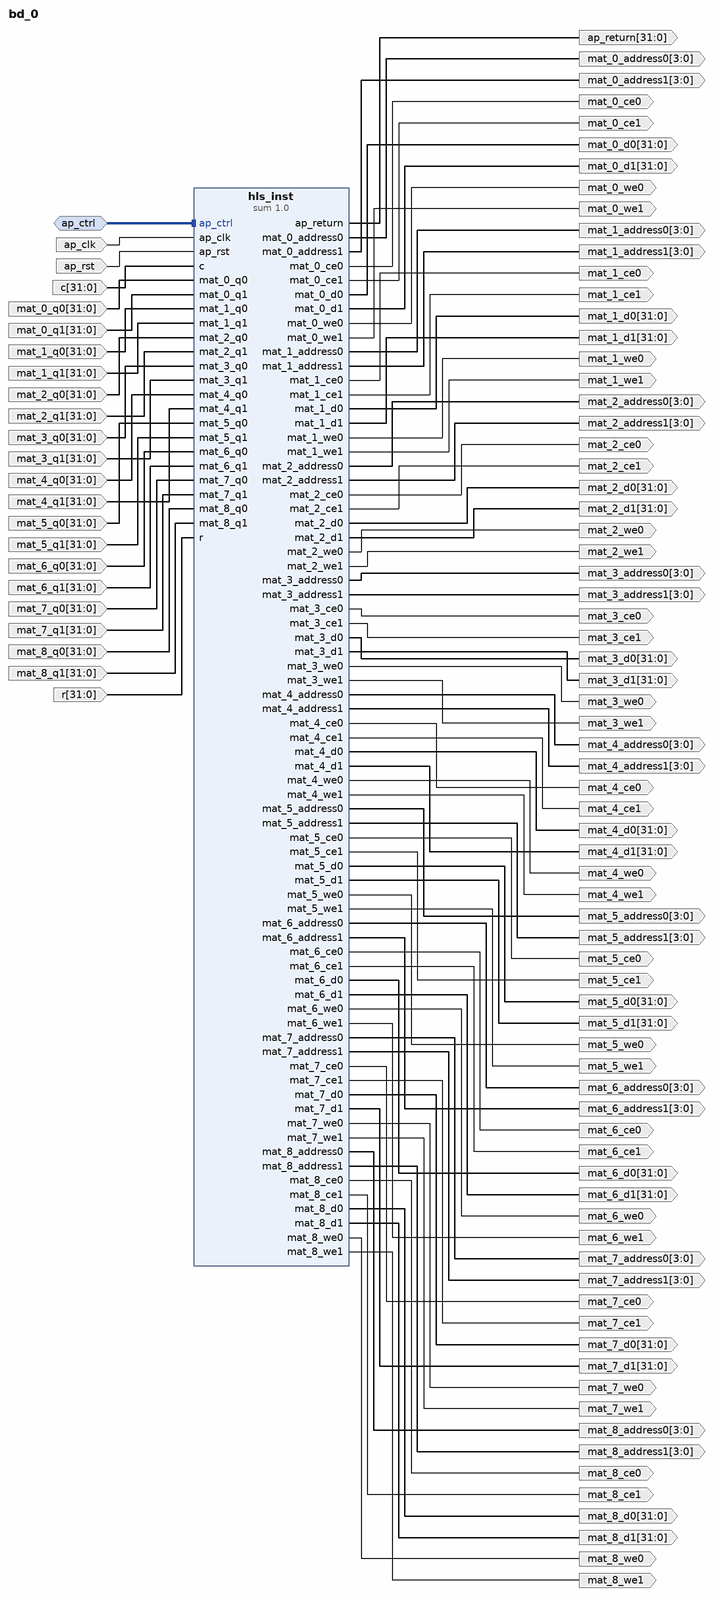
[diagram p0: block diagram of the top level]
# Vivado block design bd_0, xcvu9p-flgc2104-1-e, Vivado 2019.1
create_bd_design bd_0

create_bd_intf_port -mode Slave -vlnv xilinx.com:interface:acc_handshake_rtl:1.0 ap_ctrl
create_bd_port -dir I -type clk ap_clk
set_property -dict {CONFIG.FREQ_HZ 359000000.0} [get_bd_ports ap_clk]
create_bd_port -dir O -from 31 -to 0 -type data ap_return
create_bd_port -dir I -type rst ap_rst
set_property -dict {CONFIG.POLARITY ACTIVE_HIGH} [get_bd_ports ap_rst]
create_bd_port -dir I -from 31 -to 0 -type data c
create_bd_port -dir O -from 3 -to 0 -type data mat_0_address0
create_bd_port -dir O -from 3 -to 0 -type data mat_0_address1
create_bd_port -dir O mat_0_ce0
create_bd_port -dir O mat_0_ce1
create_bd_port -dir O -from 31 -to 0 -type data mat_0_d0
create_bd_port -dir O -from 31 -to 0 -type data mat_0_d1
create_bd_port -dir I -from 31 -to 0 -type data mat_0_q0
create_bd_port -dir I -from 31 -to 0 -type data mat_0_q1
create_bd_port -dir O mat_0_we0
create_bd_port -dir O mat_0_we1
create_bd_port -dir O -from 3 -to 0 -type data mat_1_address0
create_bd_port -dir O -from 3 -to 0 -type data mat_1_address1
create_bd_port -dir O mat_1_ce0
create_bd_port -dir O mat_1_ce1
create_bd_port -dir O -from 31 -to 0 -type data mat_1_d0
create_bd_port -dir O -from 31 -to 0 -type data mat_1_d1
create_bd_port -dir I -from 31 -to 0 -type data mat_1_q0
create_bd_port -dir I -from 31 -to 0 -type data mat_1_q1
create_bd_port -dir O mat_1_we0
create_bd_port -dir O mat_1_we1
create_bd_port -dir O -from 3 -to 0 -type data mat_2_address0
create_bd_port -dir O -from 3 -to 0 -type data mat_2_address1
create_bd_port -dir O mat_2_ce0
create_bd_port -dir O mat_2_ce1
create_bd_port -dir O -from 31 -to 0 -type data mat_2_d0
create_bd_port -dir O -from 31 -to 0 -type data mat_2_d1
create_bd_port -dir I -from 31 -to 0 -type data mat_2_q0
create_bd_port -dir I -from 31 -to 0 -type data mat_2_q1
create_bd_port -dir O mat_2_we0
create_bd_port -dir O mat_2_we1
create_bd_port -dir O -from 3 -to 0 -type data mat_3_address0
create_bd_port -dir O -from 3 -to 0 -type data mat_3_address1
create_bd_port -dir O mat_3_ce0
create_bd_port -dir O mat_3_ce1
create_bd_port -dir O -from 31 -to 0 -type data mat_3_d0
create_bd_port -dir O -from 31 -to 0 -type data mat_3_d1
create_bd_port -dir I -from 31 -to 0 -type data mat_3_q0
create_bd_port -dir I -from 31 -to 0 -type data mat_3_q1
create_bd_port -dir O mat_3_we0
create_bd_port -dir O mat_3_we1
create_bd_port -dir O -from 3 -to 0 -type data mat_4_address0
create_bd_port -dir O -from 3 -to 0 -type data mat_4_address1
create_bd_port -dir O mat_4_ce0
create_bd_port -dir O mat_4_ce1
create_bd_port -dir O -from 31 -to 0 -type data mat_4_d0
create_bd_port -dir O -from 31 -to 0 -type data mat_4_d1
create_bd_port -dir I -from 31 -to 0 -type data mat_4_q0
create_bd_port -dir I -from 31 -to 0 -type data mat_4_q1
create_bd_port -dir O mat_4_we0
create_bd_port -dir O mat_4_we1
create_bd_port -dir O -from 3 -to 0 -type data mat_5_address0
create_bd_port -dir O -from 3 -to 0 -type data mat_5_address1
create_bd_port -dir O mat_5_ce0
create_bd_port -dir O mat_5_ce1
create_bd_port -dir O -from 31 -to 0 -type data mat_5_d0
create_bd_port -dir O -from 31 -to 0 -type data mat_5_d1
create_bd_port -dir I -from 31 -to 0 -type data mat_5_q0
create_bd_port -dir I -from 31 -to 0 -type data mat_5_q1
create_bd_port -dir O mat_5_we0
create_bd_port -dir O mat_5_we1
create_bd_port -dir O -from 3 -to 0 -type data mat_6_address0
create_bd_port -dir O -from 3 -to 0 -type data mat_6_address1
create_bd_port -dir O mat_6_ce0
create_bd_port -dir O mat_6_ce1
create_bd_port -dir O -from 31 -to 0 -type data mat_6_d0
create_bd_port -dir O -from 31 -to 0 -type data mat_6_d1
create_bd_port -dir I -from 31 -to 0 -type data mat_6_q0
create_bd_port -dir I -from 31 -to 0 -type data mat_6_q1
create_bd_port -dir O mat_6_we0
create_bd_port -dir O mat_6_we1
create_bd_port -dir O -from 3 -to 0 -type data mat_7_address0
create_bd_port -dir O -from 3 -to 0 -type data mat_7_address1
create_bd_port -dir O mat_7_ce0
create_bd_port -dir O mat_7_ce1
create_bd_port -dir O -from 31 -to 0 -type data mat_7_d0
create_bd_port -dir O -from 31 -to 0 -type data mat_7_d1
create_bd_port -dir I -from 31 -to 0 -type data mat_7_q0
create_bd_port -dir I -from 31 -to 0 -type data mat_7_q1
create_bd_port -dir O mat_7_we0
create_bd_port -dir O mat_7_we1
create_bd_port -dir O -from 3 -to 0 -type data mat_8_address0
create_bd_port -dir O -from 3 -to 0 -type data mat_8_address1
create_bd_port -dir O mat_8_ce0
create_bd_port -dir O mat_8_ce1
create_bd_port -dir O -from 31 -to 0 -type data mat_8_d0
create_bd_port -dir O -from 31 -to 0 -type data mat_8_d1
create_bd_port -dir I -from 31 -to 0 -type data mat_8_q0
create_bd_port -dir I -from 31 -to 0 -type data mat_8_q1
create_bd_port -dir O mat_8_we0
create_bd_port -dir O mat_8_we1
create_bd_port -dir I -from 31 -to 0 -type data r

create_bd_cell -type ip -vlnv xilinx.com:hls:sum:1.0 hls_inst

# ---- connections ----

connect_bd_intf_net -intf_net ap_ctrl_0_1 [get_bd_intf_ports ap_ctrl] [get_bd_intf_pins hls_inst/ap_ctrl]
connect_bd_net -net ap_clk_0_1 [get_bd_ports ap_clk] [get_bd_pins hls_inst/ap_clk]
connect_bd_net [get_bd_pins hls_inst/ap_return] [get_bd_ports ap_return]
connect_bd_net -net ap_rst_0_1 [get_bd_ports ap_rst] [get_bd_pins hls_inst/ap_rst]
connect_bd_net -net c_0_1 [get_bd_ports c] [get_bd_pins hls_inst/c]
connect_bd_net [get_bd_pins hls_inst/mat_0_address0] [get_bd_ports mat_0_address0]
connect_bd_net [get_bd_pins hls_inst/mat_0_address1] [get_bd_ports mat_0_address1]
connect_bd_net [get_bd_pins hls_inst/mat_0_ce0] [get_bd_ports mat_0_ce0]
connect_bd_net [get_bd_pins hls_inst/mat_0_ce1] [get_bd_ports mat_0_ce1]
connect_bd_net [get_bd_pins hls_inst/mat_0_d0] [get_bd_ports mat_0_d0]
connect_bd_net [get_bd_pins hls_inst/mat_0_d1] [get_bd_ports mat_0_d1]
connect_bd_net -net mat_0_q0_0_1 [get_bd_ports mat_0_q0] [get_bd_pins hls_inst/mat_0_q0]
connect_bd_net -net mat_0_q1_0_1 [get_bd_ports mat_0_q1] [get_bd_pins hls_inst/mat_0_q1]
connect_bd_net [get_bd_pins hls_inst/mat_0_we0] [get_bd_ports mat_0_we0]
connect_bd_net [get_bd_pins hls_inst/mat_0_we1] [get_bd_ports mat_0_we1]
connect_bd_net [get_bd_pins hls_inst/mat_1_address0] [get_bd_ports mat_1_address0]
connect_bd_net [get_bd_pins hls_inst/mat_1_address1] [get_bd_ports mat_1_address1]
connect_bd_net [get_bd_pins hls_inst/mat_1_ce0] [get_bd_ports mat_1_ce0]
connect_bd_net [get_bd_pins hls_inst/mat_1_ce1] [get_bd_ports mat_1_ce1]
connect_bd_net [get_bd_pins hls_inst/mat_1_d0] [get_bd_ports mat_1_d0]
connect_bd_net [get_bd_pins hls_inst/mat_1_d1] [get_bd_ports mat_1_d1]
connect_bd_net -net mat_1_q0_0_1 [get_bd_ports mat_1_q0] [get_bd_pins hls_inst/mat_1_q0]
connect_bd_net -net mat_1_q1_0_1 [get_bd_ports mat_1_q1] [get_bd_pins hls_inst/mat_1_q1]
connect_bd_net [get_bd_pins hls_inst/mat_1_we0] [get_bd_ports mat_1_we0]
connect_bd_net [get_bd_pins hls_inst/mat_1_we1] [get_bd_ports mat_1_we1]
connect_bd_net [get_bd_pins hls_inst/mat_2_address0] [get_bd_ports mat_2_address0]
connect_bd_net [get_bd_pins hls_inst/mat_2_address1] [get_bd_ports mat_2_address1]
connect_bd_net [get_bd_pins hls_inst/mat_2_ce0] [get_bd_ports mat_2_ce0]
connect_bd_net [get_bd_pins hls_inst/mat_2_ce1] [get_bd_ports mat_2_ce1]
connect_bd_net [get_bd_pins hls_inst/mat_2_d0] [get_bd_ports mat_2_d0]
connect_bd_net [get_bd_pins hls_inst/mat_2_d1] [get_bd_ports mat_2_d1]
connect_bd_net -net mat_2_q0_0_1 [get_bd_ports mat_2_q0] [get_bd_pins hls_inst/mat_2_q0]
connect_bd_net -net mat_2_q1_0_1 [get_bd_ports mat_2_q1] [get_bd_pins hls_inst/mat_2_q1]
connect_bd_net [get_bd_pins hls_inst/mat_2_we0] [get_bd_ports mat_2_we0]
connect_bd_net [get_bd_pins hls_inst/mat_2_we1] [get_bd_ports mat_2_we1]
connect_bd_net [get_bd_pins hls_inst/mat_3_address0] [get_bd_ports mat_3_address0]
connect_bd_net [get_bd_pins hls_inst/mat_3_address1] [get_bd_ports mat_3_address1]
connect_bd_net [get_bd_pins hls_inst/mat_3_ce0] [get_bd_ports mat_3_ce0]
connect_bd_net [get_bd_pins hls_inst/mat_3_ce1] [get_bd_ports mat_3_ce1]
connect_bd_net [get_bd_pins hls_inst/mat_3_d0] [get_bd_ports mat_3_d0]
connect_bd_net [get_bd_pins hls_inst/mat_3_d1] [get_bd_ports mat_3_d1]
connect_bd_net -net mat_3_q0_0_1 [get_bd_ports mat_3_q0] [get_bd_pins hls_inst/mat_3_q0]
connect_bd_net -net mat_3_q1_0_1 [get_bd_ports mat_3_q1] [get_bd_pins hls_inst/mat_3_q1]
connect_bd_net [get_bd_pins hls_inst/mat_3_we0] [get_bd_ports mat_3_we0]
connect_bd_net [get_bd_pins hls_inst/mat_3_we1] [get_bd_ports mat_3_we1]
connect_bd_net [get_bd_pins hls_inst/mat_4_address0] [get_bd_ports mat_4_address0]
connect_bd_net [get_bd_pins hls_inst/mat_4_address1] [get_bd_ports mat_4_address1]
connect_bd_net [get_bd_pins hls_inst/mat_4_ce0] [get_bd_ports mat_4_ce0]
connect_bd_net [get_bd_pins hls_inst/mat_4_ce1] [get_bd_ports mat_4_ce1]
connect_bd_net [get_bd_pins hls_inst/mat_4_d0] [get_bd_ports mat_4_d0]
connect_bd_net [get_bd_pins hls_inst/mat_4_d1] [get_bd_ports mat_4_d1]
connect_bd_net -net mat_4_q0_0_1 [get_bd_ports mat_4_q0] [get_bd_pins hls_inst/mat_4_q0]
connect_bd_net -net mat_4_q1_0_1 [get_bd_ports mat_4_q1] [get_bd_pins hls_inst/mat_4_q1]
connect_bd_net [get_bd_pins hls_inst/mat_4_we0] [get_bd_ports mat_4_we0]
connect_bd_net [get_bd_pins hls_inst/mat_4_we1] [get_bd_ports mat_4_we1]
connect_bd_net [get_bd_pins hls_inst/mat_5_address0] [get_bd_ports mat_5_address0]
connect_bd_net [get_bd_pins hls_inst/mat_5_address1] [get_bd_ports mat_5_address1]
connect_bd_net [get_bd_pins hls_inst/mat_5_ce0] [get_bd_ports mat_5_ce0]
connect_bd_net [get_bd_pins hls_inst/mat_5_ce1] [get_bd_ports mat_5_ce1]
connect_bd_net [get_bd_pins hls_inst/mat_5_d0] [get_bd_ports mat_5_d0]
connect_bd_net [get_bd_pins hls_inst/mat_5_d1] [get_bd_ports mat_5_d1]
connect_bd_net -net mat_5_q0_0_1 [get_bd_ports mat_5_q0] [get_bd_pins hls_inst/mat_5_q0]
connect_bd_net -net mat_5_q1_0_1 [get_bd_ports mat_5_q1] [get_bd_pins hls_inst/mat_5_q1]
connect_bd_net [get_bd_pins hls_inst/mat_5_we0] [get_bd_ports mat_5_we0]
connect_bd_net [get_bd_pins hls_inst/mat_5_we1] [get_bd_ports mat_5_we1]
connect_bd_net [get_bd_pins hls_inst/mat_6_address0] [get_bd_ports mat_6_address0]
connect_bd_net [get_bd_pins hls_inst/mat_6_address1] [get_bd_ports mat_6_address1]
connect_bd_net [get_bd_pins hls_inst/mat_6_ce0] [get_bd_ports mat_6_ce0]
connect_bd_net [get_bd_pins hls_inst/mat_6_ce1] [get_bd_ports mat_6_ce1]
connect_bd_net [get_bd_pins hls_inst/mat_6_d0] [get_bd_ports mat_6_d0]
connect_bd_net [get_bd_pins hls_inst/mat_6_d1] [get_bd_ports mat_6_d1]
connect_bd_net -net mat_6_q0_0_1 [get_bd_ports mat_6_q0] [get_bd_pins hls_inst/mat_6_q0]
connect_bd_net -net mat_6_q1_0_1 [get_bd_ports mat_6_q1] [get_bd_pins hls_inst/mat_6_q1]
connect_bd_net [get_bd_pins hls_inst/mat_6_we0] [get_bd_ports mat_6_we0]
connect_bd_net [get_bd_pins hls_inst/mat_6_we1] [get_bd_ports mat_6_we1]
connect_bd_net [get_bd_pins hls_inst/mat_7_address0] [get_bd_ports mat_7_address0]
connect_bd_net [get_bd_pins hls_inst/mat_7_address1] [get_bd_ports mat_7_address1]
connect_bd_net [get_bd_pins hls_inst/mat_7_ce0] [get_bd_ports mat_7_ce0]
connect_bd_net [get_bd_pins hls_inst/mat_7_ce1] [get_bd_ports mat_7_ce1]
connect_bd_net [get_bd_pins hls_inst/mat_7_d0] [get_bd_ports mat_7_d0]
connect_bd_net [get_bd_pins hls_inst/mat_7_d1] [get_bd_ports mat_7_d1]
connect_bd_net -net mat_7_q0_0_1 [get_bd_ports mat_7_q0] [get_bd_pins hls_inst/mat_7_q0]
connect_bd_net -net mat_7_q1_0_1 [get_bd_ports mat_7_q1] [get_bd_pins hls_inst/mat_7_q1]
connect_bd_net [get_bd_pins hls_inst/mat_7_we0] [get_bd_ports mat_7_we0]
connect_bd_net [get_bd_pins hls_inst/mat_7_we1] [get_bd_ports mat_7_we1]
connect_bd_net [get_bd_pins hls_inst/mat_8_address0] [get_bd_ports mat_8_address0]
connect_bd_net [get_bd_pins hls_inst/mat_8_address1] [get_bd_ports mat_8_address1]
connect_bd_net [get_bd_pins hls_inst/mat_8_ce0] [get_bd_ports mat_8_ce0]
connect_bd_net [get_bd_pins hls_inst/mat_8_ce1] [get_bd_ports mat_8_ce1]
connect_bd_net [get_bd_pins hls_inst/mat_8_d0] [get_bd_ports mat_8_d0]
connect_bd_net [get_bd_pins hls_inst/mat_8_d1] [get_bd_ports mat_8_d1]
connect_bd_net -net mat_8_q0_0_1 [get_bd_ports mat_8_q0] [get_bd_pins hls_inst/mat_8_q0]
connect_bd_net -net mat_8_q1_0_1 [get_bd_ports mat_8_q1] [get_bd_pins hls_inst/mat_8_q1]
connect_bd_net [get_bd_pins hls_inst/mat_8_we0] [get_bd_ports mat_8_we0]
connect_bd_net [get_bd_pins hls_inst/mat_8_we1] [get_bd_ports mat_8_we1]
connect_bd_net -net r_0_1 [get_bd_ports r] [get_bd_pins hls_inst/r]

validate_bd_design
save_bd_design
